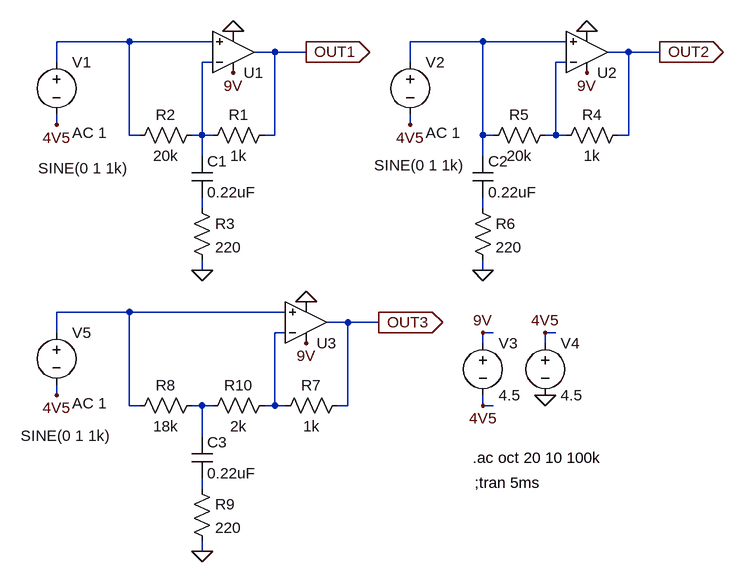
[diagram p0: schematic TubeScreamer_ToneCircuit.asc]
TubeScreamer_ToneCircuit.asc, the LTspice schematic file:
Version 4
SHEET 1 1056 1396
WIRE 0 560 -112 560
WIRE 128 560 0 560
WIRE 544 560 432 560
WIRE 672 560 544 560
WIRE 224 576 192 576
WIRE 272 576 224 576
WIRE 768 576 736 576
WIRE 816 576 768 576
WIRE -112 592 -112 560
WIRE 128 592 112 592
WIRE 432 592 432 560
WIRE 672 592 656 592
WIRE -112 688 -112 672
WIRE 432 688 432 672
WIRE 0 704 0 560
WIRE 16 704 0 704
WIRE 112 704 112 592
WIRE 112 704 96 704
WIRE 128 704 112 704
WIRE 224 704 224 576
WIRE 224 704 208 704
WIRE 544 704 544 560
WIRE 560 704 544 704
WIRE 656 704 656 592
WIRE 656 704 640 704
WIRE 672 704 656 704
WIRE 768 704 768 576
WIRE 768 704 752 704
WIRE 112 736 112 704
WIRE 544 736 544 704
WIRE 112 816 112 800
WIRE 544 816 544 800
WIRE 112 912 112 896
WIRE 544 912 544 896
WIRE 0 976 -112 976
WIRE 240 976 0 976
WIRE 336 992 304 992
WIRE 384 992 336 992
WIRE -112 1008 -112 976
WIRE 240 1008 224 1008
WIRE 560 1008 544 1008
WIRE 656 1008 640 1008
WIRE 544 1024 544 1008
WIRE 640 1024 640 1008
WIRE -112 1104 -112 1088
WIRE 0 1120 0 976
WIRE 16 1120 0 1120
WIRE 112 1120 96 1120
WIRE 128 1120 112 1120
WIRE 224 1120 224 1008
WIRE 224 1120 208 1120
WIRE 240 1120 224 1120
WIRE 336 1120 336 992
WIRE 336 1120 320 1120
WIRE 544 1120 544 1104
WIRE 560 1120 544 1120
WIRE 112 1168 112 1120
WIRE 112 1248 112 1232
WIRE 112 1344 112 1328
FLAG 112 912 0
FLAG -112 688 4V5
FLAG 544 912 0
FLAG 432 688 4V5
FLAG 272 576 OUT1
IOPIN 272 576 Out
FLAG 816 576 OUT2
IOPIN 816 576 Out
FLAG 160 544 0
FLAG 704 544 0
FLAG 160 608 9V
FLAG 704 608 9V
FLAG 544 1120 4V5
FLAG 544 1008 9V
FLAG 640 1104 0
FLAG 640 1008 4V5
FLAG 112 1344 0
FLAG -112 1104 4V5
FLAG 384 992 OUT3
IOPIN 384 992 Out
FLAG 272 960 0
FLAG 272 1024 9V
SYMBOL res 224 688 R90
WINDOW 0 0 56 VBottom 2
WINDOW 3 32 56 VTop 2
SYMATTR InstName R1
SYMATTR Value 1k
SYMBOL res 112 688 R90
WINDOW 0 0 56 VBottom 2
WINDOW 3 32 56 VTop 2
SYMATTR InstName R2
SYMATTR Value 20k
SYMBOL res 96 800 R0
SYMATTR InstName R3
SYMATTR Value 220
SYMBOL cap 96 736 R0
SYMATTR InstName C1
SYMATTR Value 0.22uF
SYMBOL voltage -112 576 R0
WINDOW 3 -28 179 Left 2
WINDOW 123 24 124 Left 2
WINDOW 39 0 0 Left 2
SYMATTR InstName V1
SYMATTR Value SINE(0 1 1k)
SYMATTR Value2 AC 1
SYMBOL res 768 688 R90
WINDOW 0 0 56 VBottom 2
WINDOW 3 32 56 VTop 2
SYMATTR InstName R4
SYMATTR Value 1k
SYMBOL res 656 688 R90
WINDOW 0 0 56 VBottom 2
WINDOW 3 32 56 VTop 2
SYMATTR InstName R5
SYMATTR Value 20k
SYMBOL res 528 800 R0
SYMATTR InstName R6
SYMATTR Value 220
SYMBOL cap 528 736 R0
SYMATTR InstName C2
SYMATTR Value 0.22uF
SYMBOL voltage 432 576 R0
WINDOW 3 -55 174 Left 2
WINDOW 123 24 124 Left 2
WINDOW 39 0 0 Left 2
SYMATTR InstName V2
SYMATTR Value SINE(0 1 1k)
SYMATTR Value2 AC 1
SYMBOL Opamps\\UniversalOpamp2 160 576 M180
SYMATTR InstName U1
SYMBOL Opamps\\UniversalOpamp2 704 576 M180
SYMATTR InstName U2
SYMBOL voltage 544 1008 R0
WINDOW 123 0 0 Left 2
WINDOW 39 0 0 Left 2
SYMATTR InstName V3
SYMATTR Value 4.5
SYMBOL voltage 640 1008 R0
WINDOW 123 0 0 Left 2
WINDOW 39 0 0 Left 2
SYMATTR InstName V4
SYMATTR Value 4.5
SYMBOL res 336 1104 R90
WINDOW 0 0 56 VBottom 2
WINDOW 3 32 56 VTop 2
SYMATTR InstName R7
SYMATTR Value 1k
SYMBOL res 112 1104 R90
WINDOW 0 0 56 VBottom 2
WINDOW 3 32 56 VTop 2
SYMATTR InstName R8
SYMATTR Value 18k
SYMBOL res 96 1232 R0
SYMATTR InstName R9
SYMATTR Value 220
SYMBOL cap 96 1168 R0
SYMATTR InstName C3
SYMATTR Value 0.22uF
SYMBOL voltage -112 992 R0
WINDOW 3 -55 174 Left 2
WINDOW 123 24 124 Left 2
WINDOW 39 0 0 Left 2
SYMATTR InstName V5
SYMATTR Value SINE(0 1 1k)
SYMATTR Value2 AC 1
SYMBOL Opamps\\UniversalOpamp2 272 992 M180
SYMATTR InstName U3
SYMBOL res 224 1104 R90
WINDOW 0 0 56 VBottom 2
WINDOW 3 32 56 VTop 2
SYMATTR InstName R10
SYMATTR Value 2k
TEXT 528 1200 Left 2 !.ac oct 20 10 100k
TEXT 531 1239 Left 2 !;tran 5ms

The netlist it stands for:
* TubeScreamer_ToneCircuit.asc
R1 OUT1 N003 1k
R2 N003 N001 20k
R3 N005 0 220
C1 N003 N005 0.22uF
V1 N001 4V5 SINE(0 1 1k) AC 1
R4 OUT2 N004 1k
R5 N004 N002 20k
R6 N006 0 220
C2 N002 N006 0.22uF
V2 N002 4V5 SINE(0 1 1k) AC 1
XU1 N001 N003 9V 0 OUT1 level.2 Avol=1Meg GBW=10Meg Slew=10Meg ilimit=25m rail=0 Vos=0 phimargin=45 en=0 enk=0 in=0 ink=0 Rin=500Meg  ; pins IN+ IN- V+ V- OUT
XU2 N002 N004 9V 0 OUT2 level.2 Avol=1Meg GBW=10Meg Slew=10Meg ilimit=25m rail=0 Vos=0 phimargin=45 en=0 enk=0 in=0 ink=0 Rin=500Meg  ; pins IN+ IN- V+ V- OUT
V3 9V 4V5 4.5
V4 4V5 0 4.5
R7 OUT3 N008 1k
R8 N009 N007 18k
R9 N010 0 220
C3 N009 N010 0.22uF
V5 N007 4V5 SINE(0 1 1k) AC 1
XU3 N007 N008 9V 0 OUT3 level.2 Avol=1Meg GBW=10Meg Slew=10Meg ilimit=25m rail=0 Vos=0 phimargin=45 en=0 enk=0 in=0 ink=0 Rin=500Meg  ; pins IN+ IN- V+ V- OUT
R10 N008 N009 2k
.ac oct 20 10 100k
;tran 5ms
.lib UniversalOpamps2.sub
.backanno
.end